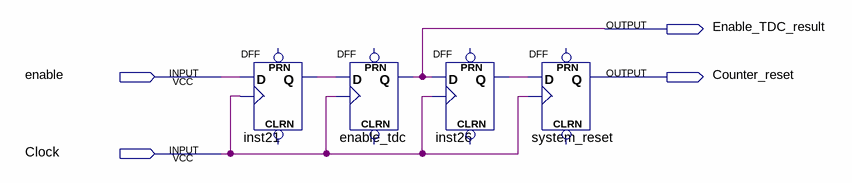
[diagram p0: schematic sheet]
// Quartus schematic system_reset.bdf as structural Verilog: 4 symbols, 4 pins
module system_reset (
  input  enable,
  input  Clock,
  output Enable_TDC_result,
  output Counter_reset
);

  wire inst21_q, inst26_q;

  DFF inst21 (.CLK(Clock), .D(enable), .Q(inst21_q));  // open: CLRN, PRN
  DFF enable_tdc (.CLK(Clock), .D(inst21_q), .Q(Enable_TDC_result));  // open: CLRN, PRN
  DFF inst26 (.CLK(Clock), .D(Enable_TDC_result), .Q(inst26_q));  // open: CLRN, PRN
  DFF system_reset (.CLK(Clock), .D(inst26_q), .Q(Counter_reset));  // open: CLRN, PRN
endmodule
